# Altium schematic sheet [02] - BLOCK DIAGRAM.SchDoc: DWM1003
size A3; DocumentNumber: 2; Revision: v2; SheetNumber: 2; SheetTotal: 7; SheetFunction: Block Diagram
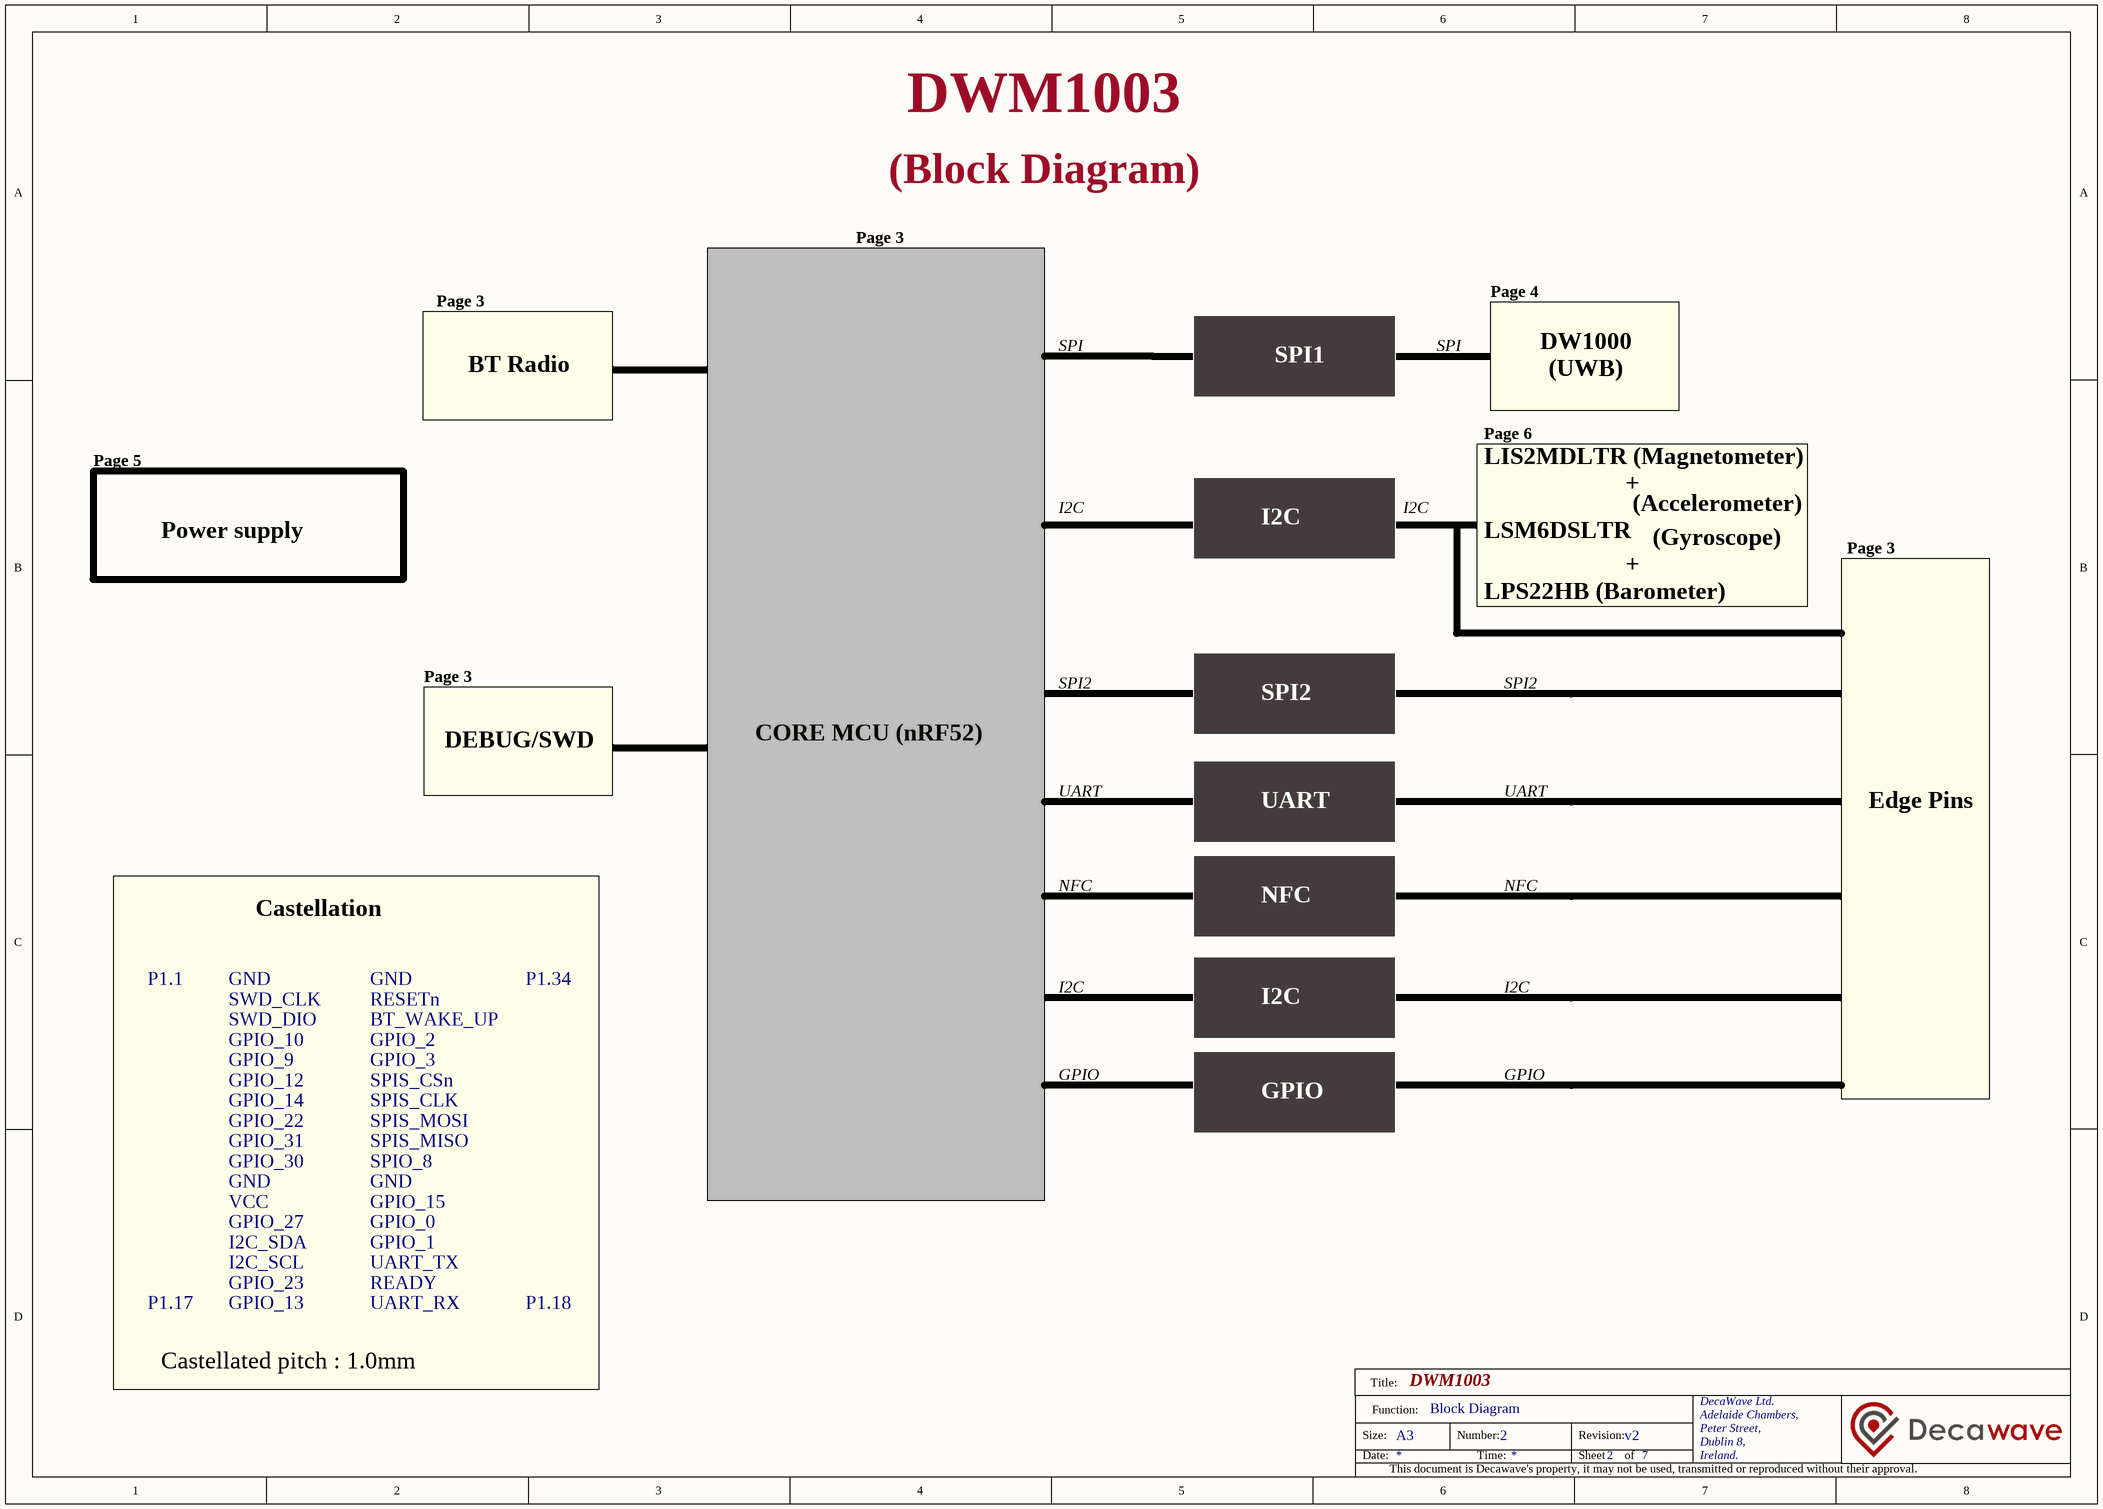
[diagram p0: [02] - BLOCK DIAGRAM.SchDoc]

## Notes on the sheet
- DWM1003
- Page 3
- (Block Diagram)
- Page 4
- BT Radio
- SPI
- SPI1
- DW1000
- (UWB)
- Page 6
- Page 5
- I2C
- LIS2MDLTR (Magnetometer)
- +
- (Accelerometer)
- Power supply
- LSM6DSLTR
- (Gyroscope)
- LPS22HB (Barometer)
- SPI2
- DEBUG/SWD
- CORE MCU (nRF52)
- UART
- Edge Pins
- Castellation
- NFC
- P1.1
- GND
- P1.34
- SWD_CLK
- SWD_DIO
- GPIO_10
- RESETn
- BT_WAKE_UP
- GPIO_2
- GPIO_9
- GPIO_12
- GPIO_14
- GPIO_22
- GPIO_3
- SPIS_CSn
- SPIS_CLK
- SPIS_MOSI
- GPIO
- GPIO_30
- GPIO_31
- SPIS_MISO
- SPIO_8
- VCC
- GPIO_27
- I2C_SDA
- GPIO_15
- GPIO_0
- GPIO_1
- P1.17
- GPIO_13
- GPIO_23
- I2C_SCL
- UART_TX
- READY
- UART_RX
- P1.18
- Castellated pitch : 1.0mm
- Title:
- Size:
- Date:
- Function:
- A3
- Number:
- Time:
- Revision:
- Sheet
- of
- DecaWave Ltd.
- Adelaide Chambers,
- Peter Street,
- Dublin 8,
- Ireland.
- This document is Decawave's property, it may not be used, transmitted or reproduced without their approval.